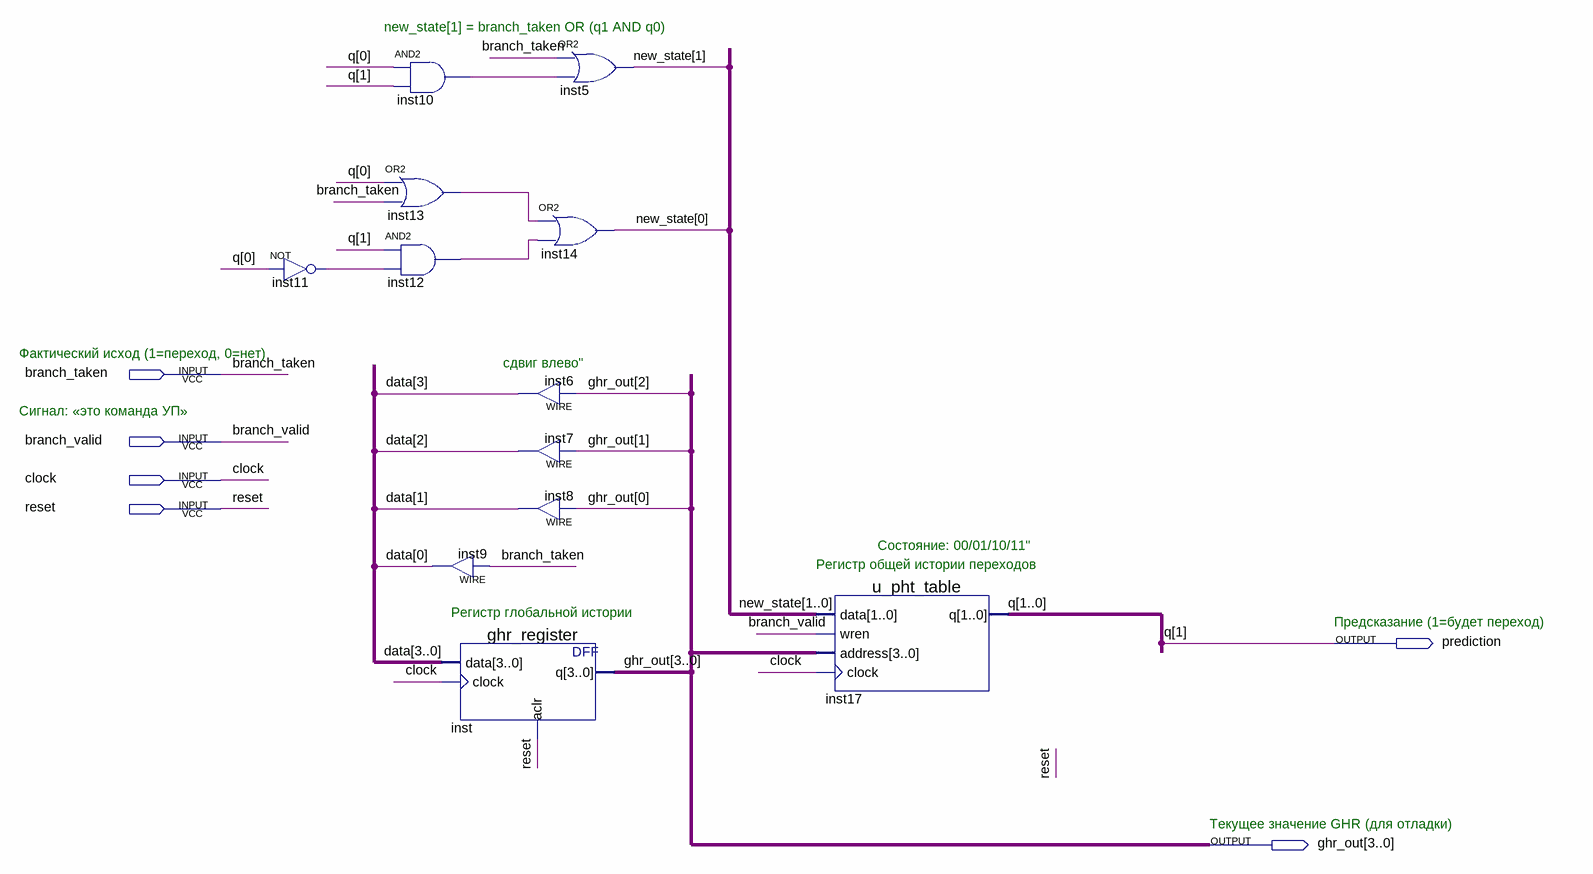
[diagram p0: schematic sheet]
// Quartus schematic branch_predictor.bdf as structural Verilog: 12 symbols, 6 pins
module branch_predictor (
  input  branch_taken,
  input  branch_valid,
  input  clock,
  input  reset,
  output prediction,
  output [3:0] ghr_out
);

  wire inst10_out, inst11_out, inst12_out, inst13_out;
  wire [0:0] q;
  wire [1:0] new_state;
  wire [3:0] data;

  not inst11 (inst11_out, q[0]);
  and inst10 (inst10_out, q[0], prediction);
  or inst13 (inst13_out, q[0], branch_taken);
  and inst12 (inst12_out, prediction, inst11_out);
  assign data[0] = branch_taken;  // WIRE inst9
  ghr_register inst (.data(data), .clock(clock), .aclr(reset), .q(ghr_out));
  assign data[3] = ghr_out[2];  // WIRE inst6
  assign data[2] = ghr_out[1];  // WIRE inst7
  assign data[1] = ghr_out[0];  // WIRE inst8
  or inst5 (new_state[1], branch_taken, inst10_out);
  or inst14 (new_state[0], inst13_out, inst12_out);
  u_pht_table inst17 (.data(new_state), .wren(branch_valid), .address(ghr_out), .clock(clock), .q({prediction, q[0]}));

  // Other names for the same wires on the sheet: q[1] = prediction

  // Notes on the sheet:
  //   new_state[1] = branch_taken OR (q1 AND q0)
  //   Фактический исход (1=переход, 0=нет)
  //    сдвиг влево"
  //   Сигнал: «это команда УП»
  //    Состояние: 00/01/10/11"
  //   Регистр общей истории переходов
  //   Регистр глобальной истории
  //   Предсказание (1=будет переход)
  //   Текущее значение GHR (для отладки)
endmodule
